# Altium schematic sheet Sheet1.SchDoc
size A4
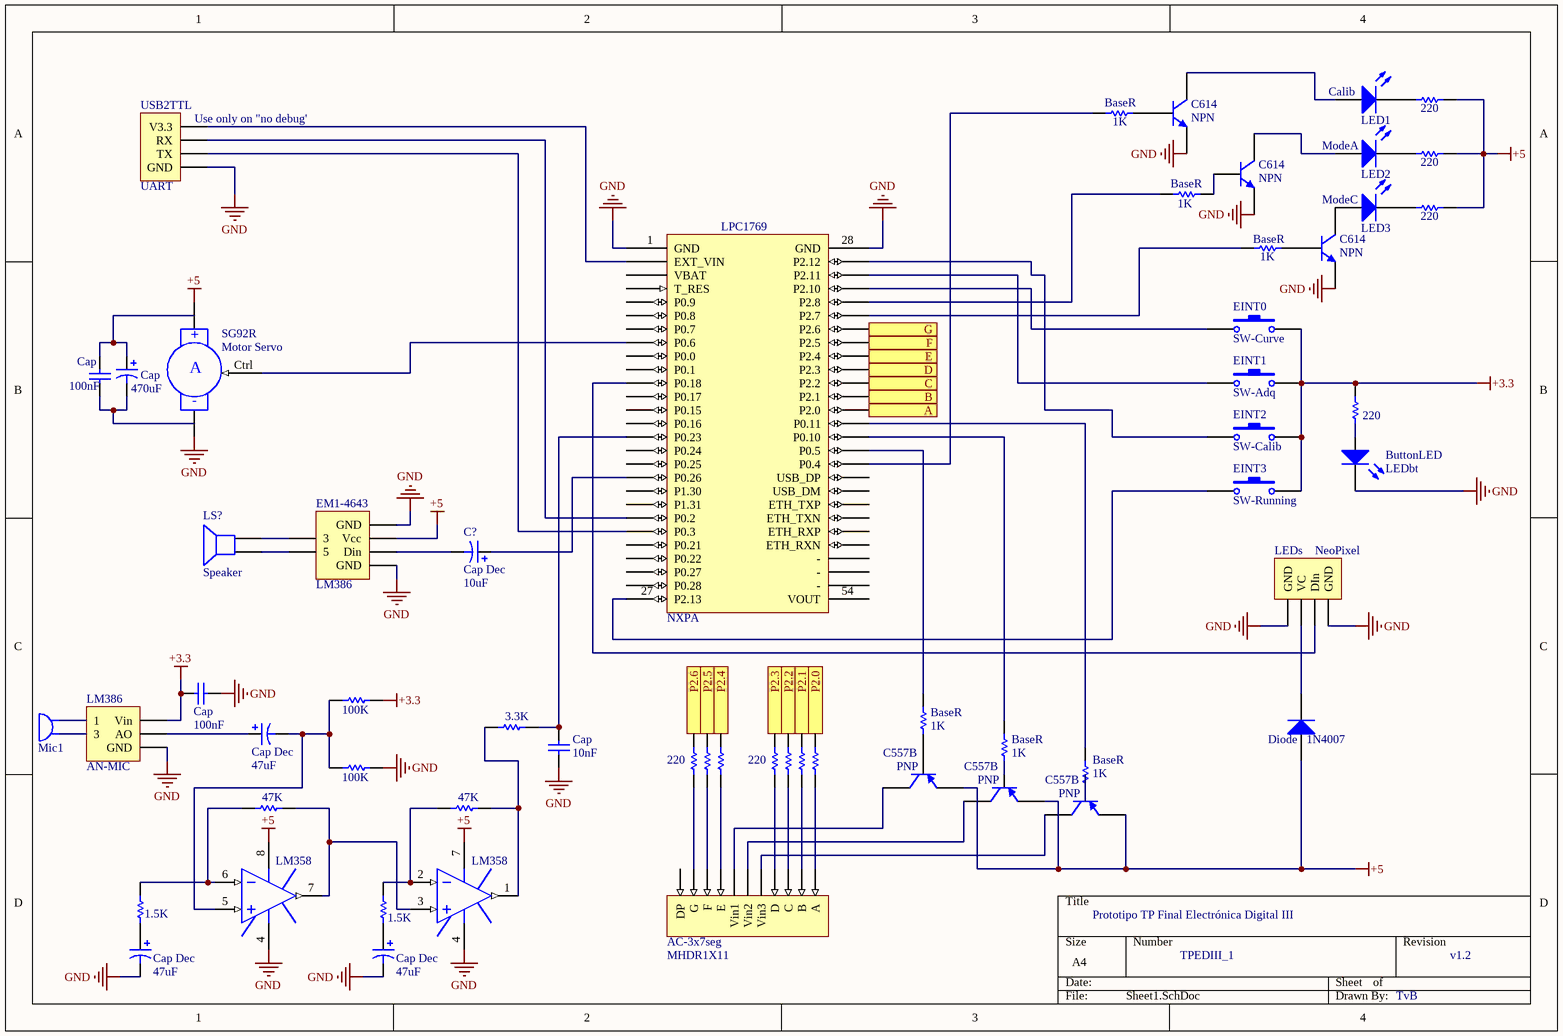
[diagram p0: Sheet1.SchDoc]

## Parts
(Parts that share a designator on the sheet are numbered #1, #2 ... from top to bottom, then left to right.)
AC-3x7seg  MHDR1X11  [MHDR1X11]
ButtonLED  LEDbt  [LED-1]
C557B#1  PNP  [SOT-23B_N]
C557B#2  PNP  [SOT-23B_N]
C557B#3  PNP  [SOT-23B_N]
C614#1  NPN  [TO-226-AA]
C614#2  NPN  [TO-226-AA]
C614#3  NPN  [TO-226-AA]
C?#1  Cap  value 470uF  [RB7.6-15]
C?#2  Cap  value 100nF  [RAD-0.3]
C?#3  Cap Dec  value 10uF  [RB7.6-15]
C?#4  Cap  value 100nF  [RAD-0.3]
C?#5  Cap Dec  value 47uF  [RB7.6-15]
C?#6  Cap  value 10nF  [RAD-0.3]
C?#7  Cap Dec  value 47uF  [RB7.6-15]
C?#8  Cap Dec  value 47uF  [RB7.6-15]
Calib  LED1  [LED-1]
D?  Diode   1N4007  [DO-41]
EINT0  SW-Curve  [SPST-2]
EINT1  SW-Adq  [SPST-2]
EINT2  SW-Calib  [SPST-2]
EINT3  SW-Running  [SPST-2]
EM1-4643  LM386  [MHDR2X4]
LEDs  NeoPixel  [HDR1X4]
LM358#1  Op Amp  [H-08A]  (value not drawn)
LM358#2  Op Amp  [H-08A]  (value not drawn)
LM386  AN-MIC  [MHDR2X3]
LS?  Speaker  [PIN2]
MK?  Mic1  [PIN2]
ModeA  LED2  [LED-1]
ModeC  LED3  [LED-1]
NXP  LPC1769  (value not drawn)  (part A of 8)
R?#1  value 220  [AXIAL-0.3]  (hidden comment: BaseR)
R?#2  BaseR  value 1K  [AXIAL-0.3]
R?#3  value 220  [AXIAL-0.3]  (hidden comment: BaseR)
R?#4  BaseR  value 1K  [AXIAL-0.3]
R?#5  value 220  [AXIAL-0.3]  (hidden comment: BaseR)
R?#6  BaseR  value 1K  [AXIAL-0.3]
R?#7  value 220  [AXIAL-0.3]  (hidden comment: BaseR)
R?#8  value 100K  [AXIAL-0.3]  (hidden comment: BaseR)
R?#9  BaseR  value 1K  [AXIAL-0.3]
R?#10  value 3.3K  [AXIAL-0.3]  (hidden comment: BaseR)
R?#11  BaseR  value 1K  [AXIAL-0.3]
R?#12  value 220  [AXIAL-0.3]  (hidden comment: BaseR)
R?#13  BaseR  [AXIAL-0.3]  (value not drawn)
R?#14  BaseR  [AXIAL-0.3]  (value not drawn)
R?#15  value 220  [AXIAL-0.3]  (hidden comment: BaseR)
R?#16  BaseR  [AXIAL-0.3]  (value not drawn)
R?#17  BaseR  [AXIAL-0.3]  (value not drawn)
R?#18  BaseR  [AXIAL-0.3]  (value not drawn)
R?#19  value 100K  [AXIAL-0.3]  (hidden comment: BaseR)
R?#20  BaseR  value 1K  [AXIAL-0.3]
R?#21  value 47K  [AXIAL-0.3]  (hidden comment: BaseR)
R?#22  value 47K  [AXIAL-0.3]  (hidden comment: BaseR)
R?#23  value 1.5K  [AXIAL-0.3]  (hidden comment: BaseR)
R?#24  value 1.5K  [AXIAL-0.3]  (hidden comment: BaseR)
SG92R  Motor Servo  [RAD-0.4]
USB2TTL  UART  [HDR1X4]

## Ports
A, B, C, D, E, F, G, P2.0, P2.1, P2.2, P2.3, P2.4, P2.5, P2.6

## Nets
+3.3: C?#4.1 EINT0.2 EINT1.2 EINT2.2 EINT3.2 LM386.2(Vin) R?#7.2 R?#8.1
+5: C557B#1.3(E) C557B#2.3(E) C557B#3.3(E) D?.1(A) EM1-4643.4(Vcc) LM358#1.8(V+) LM358#2.7(V+) R?#1.2 R?#3.2 R?#5.2 SG92R.1(+)
GND: ButtonLED.2(K) C614#1.3(E) C614#2.3(E) C614#3.3(E) C?#4.2 C?#6.1 C?#7.2 C?#8.2 EM1-4643.2(GND) EM1-4643.8(GND) LEDs.1(GND) LEDs.4(GND) LM358#1.4(V-) LM358#2.4(V-) LM386.6(GND) NXP.1(GND) NXP.28(GND) R?#19.1 SG92R.2(-) USB2TTL.1(GND)
A: NXP.42(P2.0) ; port A
B: NXP.43(P2.1) ; port B
C: NXP.44(P2.2) ; port C
D: NXP.45(P2.3) ; port D
E: NXP.46(P2.4) ; port E
F: NXP.47(P2.5) ; port F
G: NXP.48(P2.6) ; port G
P2.0: R?#18.2 ; port P2.0
P2.1: R?#17.2 ; port P2.1
P2.2: R?#16.2 ; port P2.2
P2.3: R?#15.2 ; port P2.3
P2.4: R?#14.2 ; port P2.4
P2.5: R?#13.2 ; port P2.5
P2.6: R?#12.2 ; port P2.6
NetAC-3x7seg_1: AC-3x7seg.1(A) R?#18.1
NetAC-3x7seg_2: AC-3x7seg.2(B) R?#17.1
NetAC-3x7seg_3: AC-3x7seg.3(C) R?#16.1
NetAC-3x7seg_4: AC-3x7seg.4(D) R?#15.1
NetAC-3x7seg_5: AC-3x7seg.5(Vin3) C557B#3.1(C)
NetAC-3x7seg_6: AC-3x7seg.6(Vin2) C557B#2.1(C)
NetAC-3x7seg_7: AC-3x7seg.7(Vin1) C557B#1.1(C)
NetAC-3x7seg_8: AC-3x7seg.8(E) R?#14.1
NetAC-3x7seg_9: AC-3x7seg.9(F) R?#13.1
NetAC-3x7seg_10: AC-3x7seg.10(G) R?#12.1
NetButtonLED_1: ButtonLED.1(A) R?#7.1
NetC557B#1_2: C557B#1.2(B) R?#9.1
NetC557B#2_2: C557B#2.2(B) R?#11.1
NetC557B#3_2: C557B#3.2(B) R?#20.1
NetC614#1_1: C614#1.1(C) Calib.1(A)
NetC614#1_2: C614#1.2(B) R?#2.2
NetC614#2_1: C614#2.1(C) ModeA.1(A)
NetC614#2_2: C614#2.2(B) R?#4.2
NetC614#3_1: C614#3.1(C) ModeC.1(A)
NetC614#3_2: C614#3.2(B) R?#6.2
NetC?#1_1: C?#1.1 C?#2.2
NetC?#1_2: C?#1.2 C?#2.1
NetC?#3_1: C?#3.1 NXP.18(P0.26)
NetC?#3_2: C?#3.2 EM1-4643.6(Din)
NetC?#5_1: C?#5.1 LM386.4(AO)
NetC?#5_2: C?#5.2 LM358#1.5(IN+) R?#8.2 R?#19.2
NetC?#6_2: C?#6.2 NXP.15(P0.23) R?#10.1
NetC?#7_1: C?#7.1 R?#23.2
NetC?#8_1: C?#8.1 R?#24.2
NetCalib_2: Calib.2(K) R?#1.1
NetD?_2: D?.2(K) LEDs.2(VC)
NetEINT0_1: EINT0.1 NXP.51(P2.10)
NetEINT1_1: EINT1.1 NXP.52(P2.11)
NetEINT2_1: EINT2.1 NXP.53(P2.12)
NetEINT3_1: EINT3.1 NXP.27(P2.13)
NetEM1-4643_3: EM1-4643.3 LS?.2
NetEM1-4643_5: EM1-4643.5 LS?.1
NetLEDs_3: LEDs.3(DIn) NXP.11(P0.18)
NetLM358#1_6: LM358#1.6(IN-) R?#21.2 R?#23.1
NetLM358#1_7: LM358#1.7(OUT) LM358#2.3(IN+) R?#21.1
NetLM358#2_1: LM358#2.1(OUT) R?#10.2 R?#22.1
NetLM358#2_2: LM358#2.2(IN-) R?#22.2 R?#24.1
NetLM386_1: LM386.1 MK?.2
NetLM386_3: LM386.3 MK?.1
NetModeA_2: ModeA.2(K) R?#3.1
NetModeC_2: ModeC.2(K) R?#5.1
NetNXP_2: NXP.2(EXT_VIN) USB2TTL.4(V3.3)
NetNXP_8: NXP.8(P0.6) SG92R.Ctrl
NetNXP_21: NXP.21(P0.2) USB2TTL.3(RX)
NetNXP_22: NXP.22(P0.3) USB2TTL.2(TX)
NetNXP_38: NXP.38(P0.4) R?#2.1
NetNXP_39: NXP.39(P0.5) R?#9.2
NetNXP_40: NXP.40(P0.10) R?#11.2
NetNXP_41: NXP.41(P0.11) R?#20.2
NetNXP_49: NXP.49(P2.7) R?#6.1
NetNXP_50: NXP.50(P2.8) R?#4.1

Not connected (* = marked no-connect by the designer): AC-3x7seg 11(DP); NXP 3(VBAT) 4(T_RES) 5(P0.9) 6(P0.8) 7(P0.7) 9(P0.0) 10(P0.1) 12(P0.17) 13(P0.15) 14(P0.16) 16(P0.24) 17(P0.25) 19(P1.30) 20(P1.31) 23(P0.21) 24(P0.22) 25(P0.27) 26(P0.28) 29(-) 30(-) 31(-) 32(ETH_RXN) 33(ETH_RXP) 34(ETH_TXN) 35(ETH_TXP) 36(USB_DM) 37(USB_DP) 54(VOUT)

## Notes on the sheet
- (near USB2TTL) Use only on "no debug'
- (near NXP) LPC1769
- Prototipo TP Final Electrónica Digital III
- TPEDIII_1
- v1.2
- TvB
- (in symbol Motor Servo) A

## Library data of the parts
AC-3x7seg = MHDR1X11: Header, 11-Pin; LatestRevisionDate: 17-Jul-2002; LatestRevisionNote: Re-released for DXP Platform.; Publisher: Altium Limited
ButtonLED Calib ModeA ModeC = LED1: Typical RED GaAs LED; Published: 8-Jun-2000; LatestRevisionDate: 08-Jul-2005; LatestRevisionNote: Mech Layer 1 removed.; PackageReference: LED-1; Publisher: Altium Limited; PackageDescription: LED; 2 Leads
C557B#1-C557B#3 = PNP: PNP Bipolar Transistor; Published: 8-Jun-2000; LatestRevisionDate: 29-May-2009; LatestRevisionNote: IPC-7351 Footprint Added.; PackageVersion: Aug-1999; PackageReference: SOT-23B; Publisher: Altium Limited; PackageDescription: 3-Pin SOT-23 Package 0.95 mm Pitch, 2.4 mm Lead Span
C614#1-C614#3 = NPN: NPN Bipolar Transistor; Published: 8-Jun-2000; LatestRevisionDate: 17-Jul-2002; LatestRevisionNote: Re-released for DXP Platform.; PackageReference: TO-226-AA; Publisher: Altium Limited; PackageDescription: TO, Flat Index; 3 In-Line, Axial Leads; Body Dia. 4.8mm; Leads 0.55 x 0.51 mm (max); Code_JEDEC: TO-226-AA
C?#1 C?#3 C?#5 C?#7 C?#8 = Cap Pol1: Polarized Capacitor (Radial); Published: 8-Jun-2000; LatestRevisionDate: 17-Jul-2002; LatestRevisionNote: Re-released for DXP Platform.; PackageReference: RB7.6-15; Publisher: Altium Limited; PackageDescription: Polarized Capacitor (Radial); 2 Leads
C?#2 C?#4 C?#6 = Cap: Capacitor; Published: 8-Jun-2000; LatestRevisionDate: 17-Jul-2002; LatestRevisionNote: Re-released for DXP Platform.; PackageReference: RAD-0.3; Publisher: Altium Limited; PackageDescription: Radial Cap, Thru-Hole; 2 Leads; 0.3 in Pin Spacing
D? = Diode 1N4004: 1 Amp General Purpose Rectifier; Published: 8-Jun-2000; LatestRevisionDate: 17-Jul-2002; LatestRevisionNote: Re-released for DXP Platform.; DatasheetVersion: 1998; PackageVersion: Aug-1999; PackageReference: DO-41; Publisher: Altium Limited; PackageDescription: Diode, Axial; Body 5.2 x 2.7 mm (LxDia. max), Lead Dia. 0.86 mm (max); Code_JEDEC: DO-204-AL; ComponentLink1Description: Manufacturer Link; ComponentLink1URL: http://www.fairchildsemi.com/; ComponentLink2Description: Datasheet; ComponentLink2URL: http://www.fairchildsemi.com/ds/1N%2F1N4001.pdf
EINT0-EINT3 = SW-PB: Switch; Published: 24-Mar-1999; LatestRevisionDate: 17-Jul-2002; LatestRevisionNote: Re-released for DXP Platform.; PackageReference: SPST-2; Publisher: Altium Limited; PackageDescription: Switch; 2 Leads
EM1-4643 = MHDR2X4: Header, 4-Pin, Dual row; LatestRevisionDate: 17-Jul-2002; LatestRevisionNote: Re-released for DXP Platform.; Publisher: Altium Limited
LEDs USB2TTL = Header 4: Header, 4-Pin; LatestRevisionDate: 17-Jul-2002; LatestRevisionNote: Re-released for DXP Platform.; Publisher: Altium Limited
LM358#1 LM358#2 = Op Amp: FET Operational Amplifier; Published: 8-Jun-2000; LatestRevisionDate: 17-Jul-2002; LatestRevisionNote: Re-released for DXP Platform.; DatasheetVersion: REV. B; PackageVersion: 1990; PackageReference: H-08A; Publisher: Altium Limited; PackageDescription: Can; 8 Leads; Pin Circle Dia. 5.08 mm; Lead Dia. 0.53 mm (max); ComponentLink1Description: Manufacturer Link; ComponentLink1URL: http://www.analog.com/
LM386 = MHDR2X3: Header, 3-Pin, Dual row; LatestRevisionDate: 17-Jul-2002; LatestRevisionNote: Re-released for DXP Platform.; Publisher: Altium Limited
LS? = Speaker: Loudspeaker; Published: 24-Mar-1999; LatestRevisionDate: 17-Jul-2002; LatestRevisionNote: Re-released for DXP Platform.; PackageReference: PIN2; Publisher: Altium Limited
MK? = Mic1: Microphone; Published: 24-Mar-1999; LatestRevisionDate: 17-Jul-2002; LatestRevisionNote: Re-released for DXP Platform.; PackageReference: PIN2; Publisher: Altium Limited
R?#1-R?#12 R?#15 R?#19-R?#24 = Res1: Resistor; Published: 8-Jun-2000; LatestRevisionDate: 17-Jul-2002; LatestRevisionNote: Re-released for DXP Platform.; PackageReference: AXIAL-0.3; Publisher: Altium Limited; PackageDescription: Axial Device, Thru-Hole; 2 Leads; 0.3 in Pin Spacing
R?#13 R?#14 R?#16-R?#18 = Res1: Resistor; Value: 1K; Published: 8-Jun-2000; LatestRevisionDate: 17-Jul-2002; LatestRevisionNote: Re-released for DXP Platform.; PackageReference: AXIAL-0.3; Publisher: Altium Limited; PackageDescription: Axial Device, Thru-Hole; 2 Leads; 0.3 in Pin Spacing
SG92R = Motor Servo: Servo Motor; Published: 24-Mar-1999; LatestRevisionDate: 17-Jul-2002; LatestRevisionNote: Re-released for DXP Platform.; PackageReference: RAD-0.4; Publisher: Altium Limited; PackageDescription: Radial Cap, Thru-Hole; 2 Leads; 0.4 in Pin Spacing